# EasyEDA Pro project ProPrj_USB-DAC-PRO_2024-06-16.epro, board PCB3
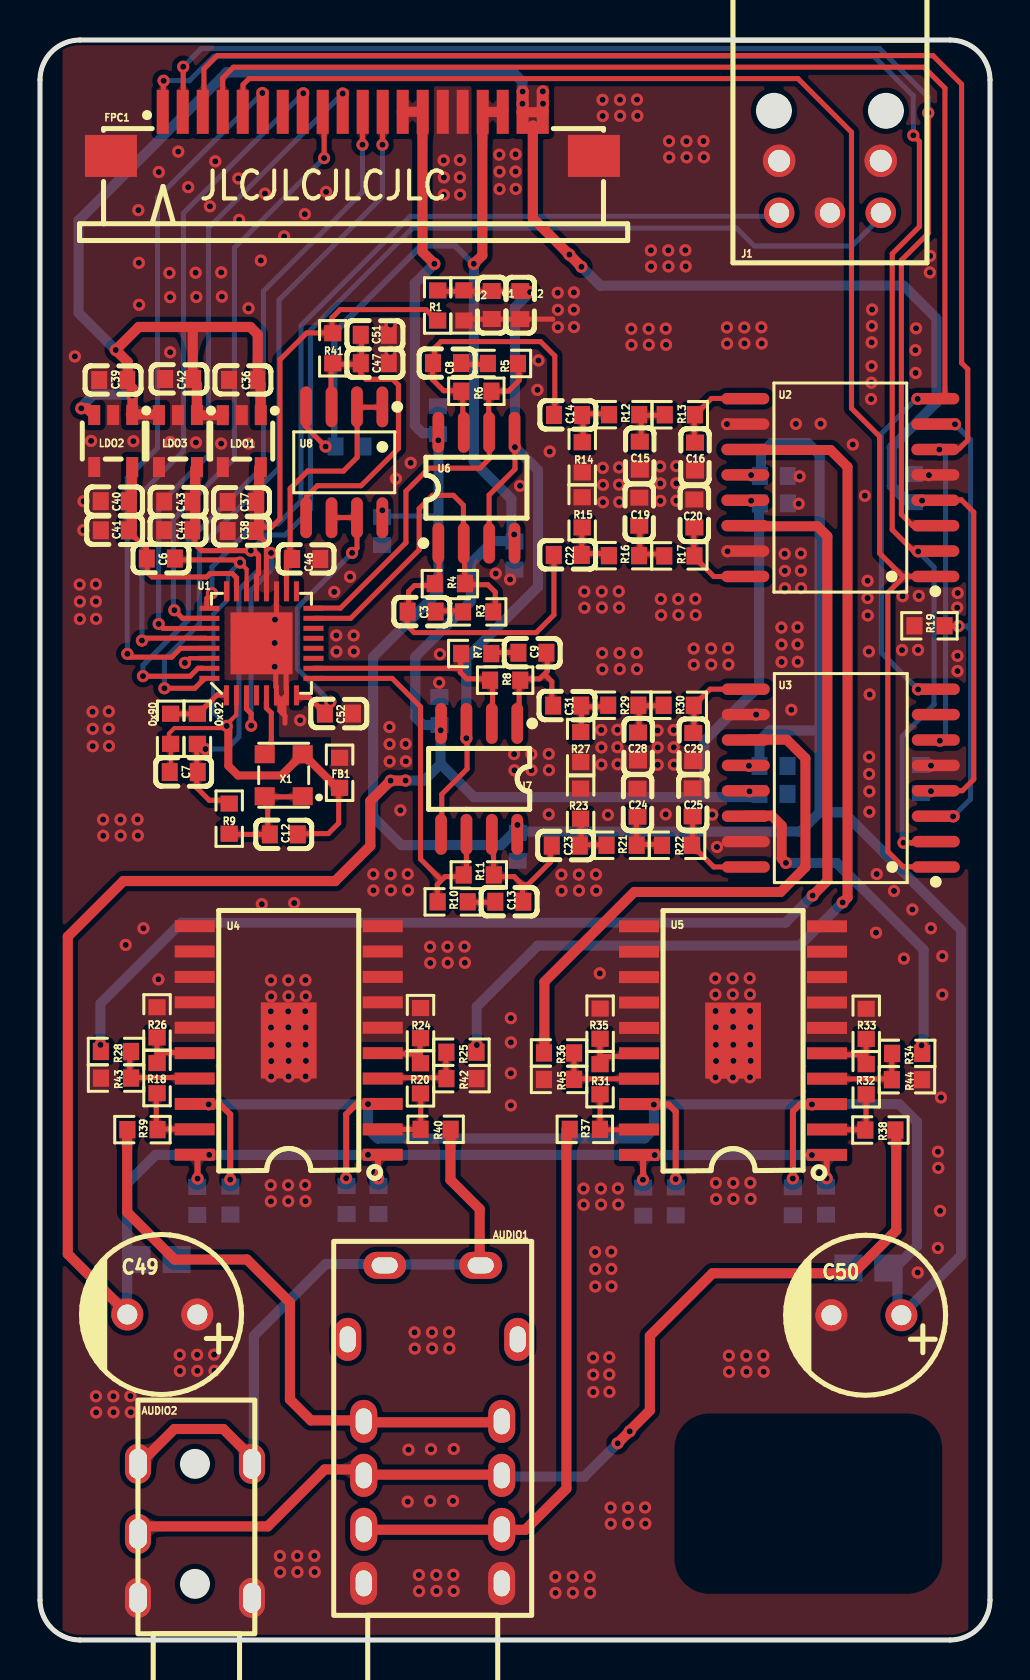
[diagram p10: board, top side]
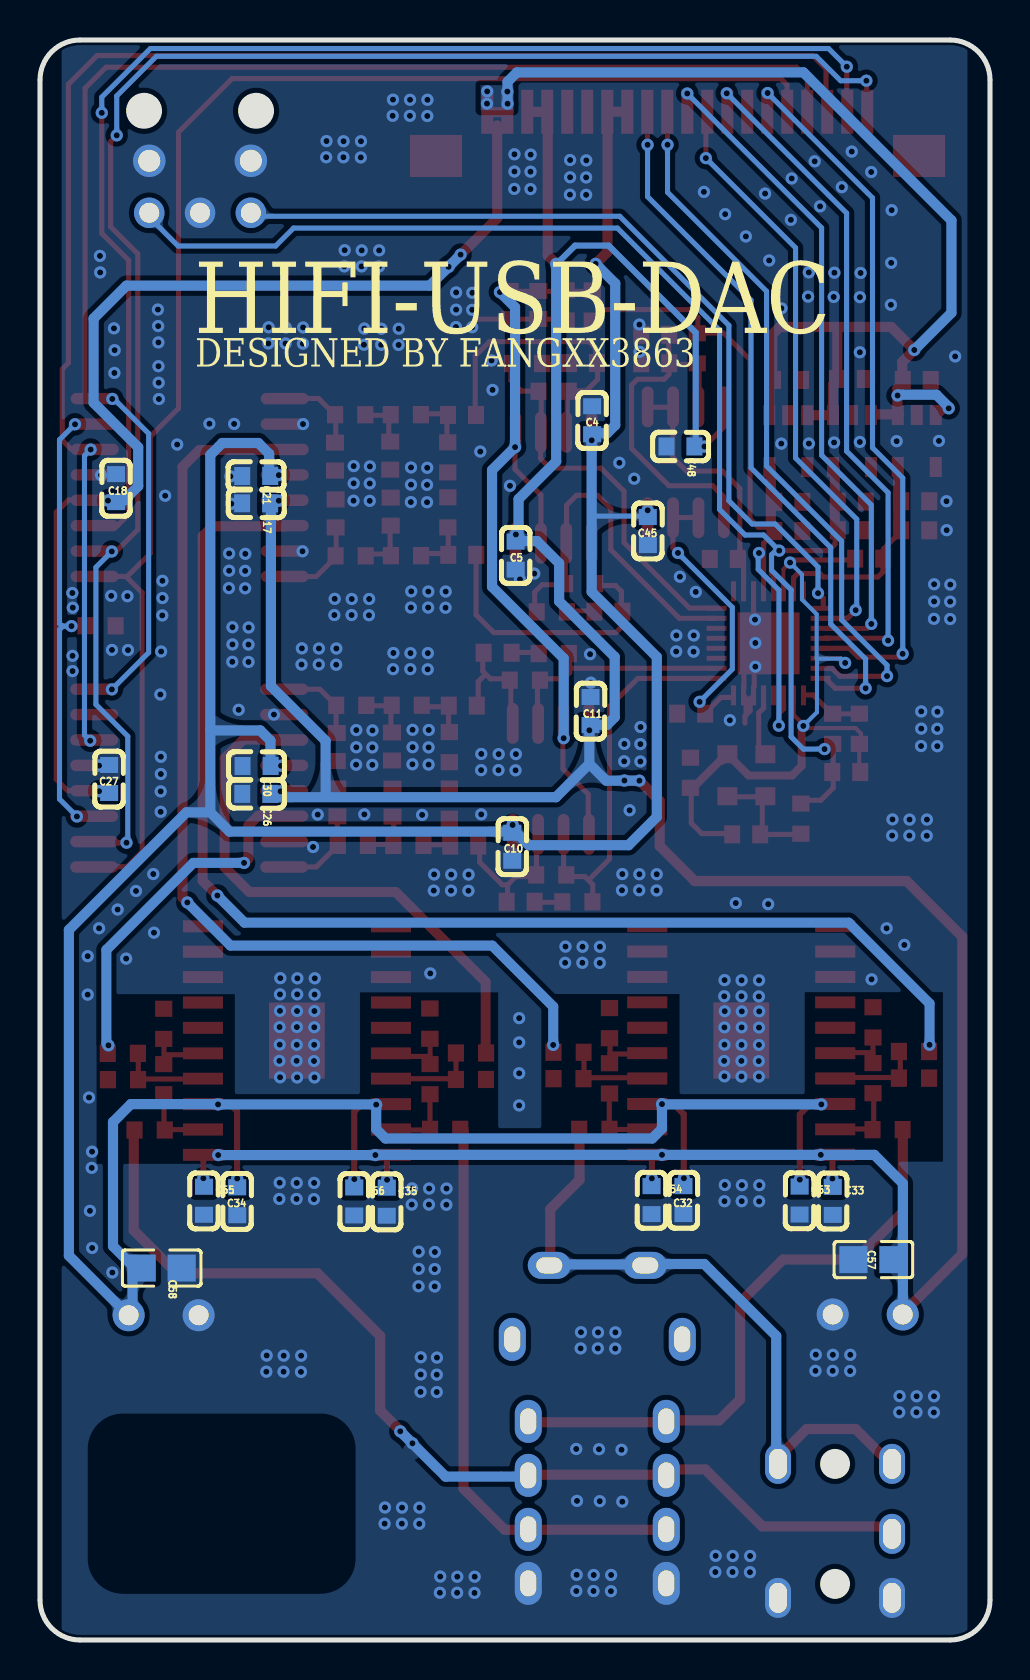
[diagram p11: board, bottom side, seen from below]

Outline 47.5 x 80 mm; copper layers: Top Layer, Bottom Layer. Coordinates in mm from the lower left corner of the outline.
Outline path: 0,78 0,2 arc(0.59,0.59) 2,0 45.5,0 arc(46.91,0.59) 47.5,2 47.5,78 arc(46.91,79.41) 45.5,80 2,80 arc(0.59,79.41) 0,78
Stack: Top Layer 0.035mm / Dielectric1 1.51mm FR4 er 4.5 / Bottom Layer 0.035mm

## Design rules (mm)
template: 自定义配置
spacing copperThickness1oz (default): track to track 0.102, other pairs 0.152 to 0.3
spacing copperThickness2oz: track to track 0.203, other pairs 0.152 to 0.3
track width copperThickness1oz (default): min 0.127, default 0.254, max 2.54
track width copperThickness2oz: min 0.203, default 0.254, max 2.54
differential pair differentialPair (default): width min 0.127, default 0.254, max 2.54; gap min 0.152, default 0.152
via viaSize (default): diameter min 0.5, default 0.61, max 10; hole min 0.3, default 0.305, max 6.3

## Placement (name value [footprint] x y rotation side)
0x90  0R  [R0603]  6.53 45.56 90 top
0x92  0R  [R0603]  7.87 45.56 90 top
AUDIO1  PJ-4.5/PJ-4005  [PJ-4005]  19.69 10.28 270 top
AUDIO2  PJ-3135-B  [AUDIO-TH_PJ-3135-B]  7.75 5.46 0 top
C1  100nF  [C0603]  22.59 66.75 90 top
C2  10uF  [C0603]  24.01 66.75 90 top
C3  100pF  [C0603]  19.08 51.42 180 top
C4  100nF  [C0603]  19.89 60.99 90 bottom
C5  100nF  [C0603]  23.72 54.22 270 bottom
C6  4.7uF  [C0603]  6.04 54.07 180 top
C7  100nF  [C0603]  7.19 43.4 0 top
C8  100pF  [C0603]  20.35 63.85 180 top
C9  100pF  [C0603]  24.62 49.36 0 top
C10  100nF  [C0603]  23.89 39.66 270 bottom
C11  100nF  [C0603]  19.97 46.45 90 bottom
C12  100nF  [C0603]  12.19 40.28 0 top
C13  100pF  [C0603]  23.47 36.91 0 top
C14  10uF  [C0603]  26.4 61.25 0 top
C15  1nF  [C0603]  29.99 59.22 90 top
C16  1nF  [C0603]  32.75 59.17 90 top
C17  100nF  [C0603]  36.69 56.83 0 bottom
C18  100nF  [C0603]  43.69 57.59 90 bottom
C19  1nF  [C0603]  29.96 56.42 90 top
C20  1nF  [C0603]  32.72 56.33 90 top
C21  100nF  [C0603]  36.69 58.2 180 bottom
C22  10uF  [C0603]  26.39 54.25 0 top
C23  10uF  [C0603]  26.29 39.72 0 top
C24  1nF  [C0603]  29.87 41.86 270 top
C25  1nF  [C0603]  32.63 41.88 270 top
C26  100nF  [C0603]  36.68 42.31 0 bottom
C27  100nF  [C0603]  44.04 43.05 90 bottom
C28  1nF  [C0603]  29.9 44.67 270 top
C29  1nF  [C0603]  32.66 44.65 270 top
C30  100nF  [C0603]  36.67 43.7 180 bottom
C31  10uF  [C0603]  26.36 46.72 0 top
C32  100nF  [C0603]  15.33 21.99 90 bottom
C33  100nF  [C0603]  7.86 21.96 90 bottom
C34  100nF  [C0603]  37.64 21.94 90 bottom
C35  100nF  [C0603]  30.16 21.92 90 bottom
C36  4.7uF  [C0603]  10.15 63 0 top
C37  4.7uF  [C0603]  10.08 56.9 0 top
C38  100nF  [C0603]  10.08 55.45 0 top
C39  4.7uF  [C0603]  3.66 63 0 top
C40  4.7uF  [C0603]  3.74 56.94 0 top
C41  100nF  [C0603]  3.74 55.48 0 top
C42  4.7uF  [C0603]  6.96 63.05 0 top
C43  4.7uF  [C0603]  6.91 56.92 0 top
C44  100nF  [C0603]  6.91 55.49 0 top
C45  100nF  [C0603]  17.11 55.45 270 bottom
C46  4.7uF  [C0603]  13.31 54.05 0 top
C47  100nF  [C0603]  16.74 63.84 180 top
C48  100nF  [C0603]  15.48 59.68 0 bottom
C49  470uF  [CAP-TH_BD8.0-P3.50-D0.6-FD]  6.11 16.28 180 top
C50  470uF  [CAP-TH_BD8.0-P3.50-D0.6-FD]  41.32 16.24 180 top
C51  10uF  [C0603]  16.74 65.26 180 top
C52  4.7uF  [C0603]  14.94 46.32 0 top
C53  100nF  [C0603]  9.52 21.97 90 bottom
C54  100nF  [C0603]  16.92 21.99 90 bottom
C55  100nF  [C0603]  39.3 21.96 90 bottom
C56  100nF  [C0603]  31.79 21.93 90 bottom
C57  10uF  [C0805]  5.83 19.02 180 bottom
C58  10uF  [C0805]  41.41 18.6 0 bottom
FB1  GZ1005E121CTF  [R0603]  14.98 43.36 90 top
FPC1  AFA07-S20FCC-00  [FPC-SMD_AFA07-S20FCC-00]  15.62 75.31 0 top
J1  -  [AUDIO-TH-SPDIF-DLT1160]  39.5 75.56 180 top
LDO1  LP5907MFX-3.3/NOPB  [SOT-23-5_L3.0-W1.7-P0.95-LS2.8-BR]  10.09 59.94 90 top
LDO2  LP5907MFX-1.5/NOPB  [SOT-23-5_L3.0-W1.7-P0.95-LS2.8-BR]  3.66 59.95 90 top
LDO3  LP5907MFX-3.3/NOPB  [SOT-23-5_L3.0-W1.7-P0.95-LS2.8-BR]  6.9 59.95 90 top
R1  10K  [R0603]  19.88 66.73 270 top
R2  8.2K  [R0603]  21.2 66.73 90 top
R3  100R  [R0603]  21.91 51.41 180 top
R4  1.2K  [R0603]  20.5 52.82 180 top
R5  100R  [R0603]  23.15 63.83 180 top
R6  1.2K  [R0603]  21.82 62.44 180 top
R7  100R  [R0603]  21.81 49.32 0 top
R8  1.2K  [R0603]  23.26 47.99 0 top
R9  10R  [R0603]  9.46 41.07 90 top
R10  100R  [R0603]  20.63 36.91 0 top
R11  1.2K  [R0603]  21.94 38.25 0 top
R12  300R  [R0603]  29.21 61.27 0 top
R13  300R  [R0603]  31.99 61.26 0 top
R14  47K  [R0603]  27.11 59.13 90 top
R15  47K  [R0603]  27.11 56.38 90 top
R16  300R  [R0603]  29.2 54.22 0 top
R17  300R  [R0603]  31.97 54.21 0 top
R18  1K  [R0603]  5.85 28.09 270 top
R19  100K  [R0603]  44.47 50.71 0 top
R20  1K  [R0603]  19.02 28.08 270 top
R21  300R  [R0603]  29.08 39.74 0 top
R22  300R  [R0603]  31.85 39.74 0 top
R23  47K  [R0603]  27.03 41.82 270 top
R24  1K  [R0603]  19.03 30.84 270 top
R25  47R  [R0603]  21.07 29.39 180 top
R26  1K  [R0603]  5.85 30.88 270 top
R27  47K  [R0603]  27.03 44.64 270 top
R28  47R  [R0603]  3.8 29.42 0 top
R29  300R  [R0603]  29.16 46.74 0 top
R30  300R  [R0603]  31.94 46.73 0 top
R31  1K  [R0603]  28 28.04 270 top
R32  1K  [R0603]  41.31 28.04 270 top
R33  1K  [R0603]  41.31 30.81 270 top
R34  47R  [R0603]  43.36 29.33 180 top
R35  1K  [R0603]  28 30.82 270 top
R36  47R  [R0603]  25.95 29.35 0 top
R37  27R  [R0603]  27.24 25.53 180 top
R38  27R  [R0603]  42.02 25.5 0 top
R39  27R  [R0603]  5.12 25.52 180 top
R40  27R  [R0603]  19.78 25.53 0 top
R41  47K  [R0603]  14.64 64.58 270 top
R42  4.7K  [R0603]  21.07 28.07 0 top
R43  4.7K  [R0603]  3.8 28.09 0 top
R44  4.7K  [R0603]  43.35 28.02 0 top
R45  4.7K  [R0603]  25.95 28.03 0 top
U1  -  [QFN32_9028Q2M]  11.07 49.83 90 top
U2  PGA2310UA/1KG4  [SOIC-16_L10.3-W7.5-P1.27-LS10.3-BL]  40.02 57.62 90 top
U3  PGA2310UA/1KG4  [SOIC-16_L10.3-W7.5-P1.27-LS10.3-BL]  40.04 43.1 90 top
U4  TPA6120A2DWPR  [HSOP-20_L12.9-W7.5-P1.27-BL-EP]  12.44 29.98 90 top
U5  TPA6120A2DWPR  [HSOP-20_L12.9-W7.5-P1.27-BL-EP]  34.65 29.97 90 top
U6  OPA1612AID  [SOIC-8_L4.9-W3.9-P1.27-LS6.2-BL]  21.82 57.61 0 top
U7  OPA1612AID  [SOIC-8_L4.9-W3.9-P1.27-LS6.2-BL]  21.96 43.06 180 top
U8  LM4562MA/NOPB  [SOIC-8_L4.9-W3.9-P1.27-LS6.0-BL]  15.21 58.89 180 top
X1  45.1584MHz  [OSC-SMD_4P-L3.2-W2.5-BL_ABRACON_AMPMEFX]  12.18 43.24 90 top

## Footprints (pads in the part's own frame, mm; a bottom-side part is the same pattern mirrored in y, then rotated)
AUDIO-TH-SPDIF-DLT1160
  round 1.524 hole 1: 1(2.54,4.2) 2(0,4.2) 3(-2.54,4.2)
  round 1.624 hole 1.1: 4(2.54,1.6) 5(-2.54,1.6)
AUDIO-TH_PJ-3135-B
  oval 1.3x2 hole 0.9x1.5: 1(-2.85,-3.35) 1(2.85,-3.35) 2(-2.85,-0.15) 3(-2.85,3.35) 3(2.85,3.35)
C0603
  rect 0.8x0.9 smd: 1(-0.7,0) 2(0.7,0)
C0805
  rect 1.41x1.35 smd: 1(-1,0) 2(1,0)
CAP-TH_BD8.0-P3.50-D0.6-FD
  round 1.6 hole 1: 1(-1.75,0) 2(1.75,0)
FPC-SMD_AFA07-S20FCC-00
  rect 0.6x2.2 smd: 1(-9.486,1.103) 2(-8.486,1.103) 3(-7.484,1.103) 4(-6.486,1.103) 5(-5.486,1.103) 6(-4.486,1.101) 7(-3.486,1.103) 8(-2.486,1.103) 9(-1.487,1.102) 10(-0.487,1.102) 11(0.513,1.102) 12(1.513,1.102) 13(2.513,1.102) 14(3.513,1.102) 15(4.515,1.101) 16(5.514,1.102) 17(6.514,1.102) 18(7.514,1.102) 19(8.514,1.102) 20(9.513,1.102)
  rect 2.6x2.1 smd: 21(-12.075,-1.103) 22(12.075,-1.103)
HSOP-20_L12.9-W7.5-P1.27-BL-EP
  rect 0.6x2 smd: 1(-5.715,-4.7) 2(-4.445,-4.7) 3(-3.175,-4.7) 4(-1.905,-4.7) 5(-0.635,-4.7) 6(0.635,-4.7) 7(1.905,-4.7) 8(3.175,-4.7) 9(4.444,-4.7) 10(5.715,-4.7) 11(5.715,4.7) 12(4.445,4.7) 13(3.175,4.7) 14(1.905,4.7) 15(0.635,4.7) 16(-0.635,4.7) 17(-1.905,4.7) 18(-3.175,4.7) 19(-4.445,4.7) 20(-5.715,4.7)
  rect 3.81x2.79 smd: 21(0,0)
OSC-SMD_4P-L3.2-W2.5-BL_ABRACON_AMPMEFX
  rect 0.9x1 smd: 1(-1.05,-0.95) 2(1.05,-0.95) 3(1.05,0.95) 4(-1.05,0.95)
PJ-4005
  oval 2.15x1.35 hole 1.3x0.8: 1(7.45,-3.5) 1(7.45,3.4) 2(4.75,-3.5) 2(4.75,3.4) 3(2.05,-3.5) 3(2.051,3.4) 4(-0.65,-3.5) 4(-0.649,3.4) 5(-4.75,4.199) 6(-4.75,-4.3)
  oval 1.35x2.15 hole 0.8x1.3: 7(-8.45,2.35) 7(-8.45,-2.45)
QFN32_9028Q2M
  rect 1.001x0.249 smd: 1(-2.601,1.75) 2(-2.601,1.25) 3(-2.601,0.75) 4(-2.601,0.249) 5(-2.601,-0.249) 6(-2.601,-0.75) 7(-2.601,-1.25) 8(-2.601,-1.75) 17(2.601,-1.75) 18(2.601,-1.25) 19(2.601,-0.75) 20(2.601,-0.249) 21(2.601,0.249) 22(2.601,0.75) 23(2.601,1.25) 24(2.601,1.75)
  rect 0.249x1.001 smd: 9(-1.75,-2.601) 10(-1.25,-2.601) 11(-0.75,-2.601) 12(-0.249,-2.601) 13(0.249,-2.601) 14(0.75,-2.601) 15(1.25,-2.601) 16(1.75,-2.601) 25(1.75,2.601) 26(1.25,2.601) 27(0.75,2.601) 28(0.249,2.601) 29(-0.249,2.601) 30(-0.75,2.601) 31(-1.25,2.601) 32(-1.75,2.601)
  rect 3.099x3.099 smd: 33(0,0)
R0603
  rect 0.806x0.864 smd: 1(-0.753,0) 2(0.753,0)
SOIC-8_L4.9-W3.9-P1.27-LS6.0-BL
  oval 0.588x2.045 smd: 1(-1.905,-2.772) 2(-0.635,-2.772) 3(0.635,-2.772) 4(1.905,-2.772) 5(1.905,2.772) 6(0.635,2.772) 7(-0.635,2.772) 8(-1.905,2.772)
SOIC-8_L4.9-W3.9-P1.27-LS6.2-BL
  oval 0.588x2.045 smd: 1(-1.905,-2.772) 2(-0.635,-2.772) 3(0.635,-2.772) 4(1.905,-2.772) 5(1.905,2.772) 6(0.635,2.772) 7(-0.635,2.772) 8(-1.905,2.772)
SOIC-16_L10.3-W7.5-P1.27-LS10.3-BL
  oval 0.574x2.401 smd: 1(-4.445,-4.75) 2(-3.175,-4.75) 3(-1.905,-4.75) 4(-0.635,-4.75) 5(0.635,-4.75) 6(1.905,-4.75) 7(3.175,-4.75) 8(4.445,-4.75) 9(4.445,4.75) 10(3.175,4.75) 11(1.905,4.75) 12(0.635,4.75) 13(-0.635,4.75) 14(-1.905,4.75) 15(-3.175,4.75) 16(-4.445,4.75)
SOT-23-5_L3.0-W1.7-P0.95-LS2.8-BR
  rect 1x0.6 smd: 1(1.3,-0.95) 2(1.3,0) 3(1.3,0.95) 4(-1.3,0.95) 5(-1.3,-0.95)

## Nets
As in the schematic.

Pads without a net: AUDIO1 5 6; U1 4 11 12 13 14 17 24; U3 7

## Via types
v1: diameter 0.61, hole 0.305, Top Layer to Bottom Layer, 492 vias

## Routing (per net, layer and track width the routed paths; a pad name or vN(x,y) marks a point on that pad's centre or on a via; arc(x,y) is an arc through that point)
5V: length 114.7
  Top Layer w0.254: 45.36,57 46.07,57 46.69,56.39 46.69,43.03 46.12,42.47 45.62,42.47 45.61,42.47
  Top Layer w0.508: v1(2.06,61.58) 2.36,61.58 2.69,61.25 ; 7.59,65.65 4.94,65.65 v1(3.79,64.5) 4.39,63.9 4.39,63.16 ; 7.59,65.65 10.52,65.65 10.89,65.28 10.89,63.11 ; 7.59,65.65 7.64,65.6 7.64,63.27 ; 7.8,61.24 9.18,61.24 9.19,61.23 ; 24.06,76.39 25.13,76.39 25.18,76.44 ; 7.65,62.96 7.85,62.76 7.85,61.48 ; 4.37,62.83 4.63,62.58 4.63,61.59 ; 5.89,61.3 5.87,61.28 4.54,61.28 ; 11.02,61.47 11.02,62.8 10.84,62.98 ; v1(27.07,68.66) 24.64,71.09 24.64,75.73
  Bottom Layer w0.508: v1(26.47,69.27) 26.47,69.26 v1(27.07,68.66) 28.01,67.72 43.18,67.72 44.82,66.08 44.82,61.86 42.59,59.64 42.59,57.69 43.31,56.97 43.93,56.97 ; v1(2.06,61.58) 2.06,61.65 2.68,62.27 4.58,62.27 v1(4.62,62.22) ; v1(3.79,64.5) 1.93,66.36 1.93,70.98 9.33,78.38 23.65,78.38 24.12,77.91 v1(24.12,76.81)
  vias: v1(24.13,77.42) v1(25.14,77.43) v1(25.15,76.82) v1(44.1,56.97) v1(44.55,42.44)
+12V: length 187.9
  Top Layer w0.305: v1(15.31,23.09) 15.31,23.09 15.31,26.29 15.82,26.8 v1(16.4,26.8) ; v1(8.43,26.78) 9.01,26.78 9.51,26.28 v1(9.51,23.02) ; v1(38.6,26.78) 37.99,26.78 37.65,26.44 37.65,23.08 v1(37.64,23.07) ; v1(30.69,26.77) 31.44,26.77 31.79,26.42 31.79,23.05
  Top Layer w0.508: 18.09,76.41 19.11,76.41 19.12,76.41 ; 19.12,75.88 19.12,69.4 v1(19.72,68.81)
  Bottom Layer w0.254: 19.85,56.28 19.76,56.19 17.23,56.19
  Bottom Layer w0.508: 23.93,40.42 38.02,40.42 38.98,41.39 ; v1(19.72,68.81) 18.74,67.83 18.74,60.74 19.14,60.34 19.87,60.34 ; 38.98,41.39 40.18,41.39 46.06,35.51 46.06,19.22 42.95,16.12 ; 38.98,41.39 38.98,45.48 ; v1(8.43,26.78) 16.39,26.78 v1(16.4,26.8) 16.4,25.57 16.89,25.08 30.22,25.08 30.69,25.54 v1(30.69,26.77) 30.7,26.78 v1(38.6,26.78) 38.61,26.79 42.95,26.79 43.85,25.9 43.85,19.69 42.87,18.72 42.87,16.26 ; 38.98,45.48 36.49,45.48 35.98,44.97 35.98,43.98 35.91,43.92 ; 38.98,45.48 38.98,59.25 38.38,59.85 36.58,59.85 36.04,59.31 36.04,58.28 36.03,58.26 ; 23.66,40.34 23.06,39.74 18.07,39.74 16.66,41.15 16.66,49.15 19.92,52.41 v1(19.92,59.98)
  vias: v1(17.12,56.48) v1(23.87,40.75) v1(31.78,23.05) v1(35.45,43.71) v1(35.56,58.24)
-12V: length 177.1
  Top Layer w0.254: 13.27,61.13 13.27,60.68 v1(14.28,59.67)
  Top Layer w0.305: 7.87,24.26 7.87,23.08 v1(7.88,23.07) ; 39.33,24.26 v1(39.33,23.09) ; 30.16,24.26 30.16,23.02 v1(30.15,23.01) ; v1(16.91,23.08) 16.9,23.09 16.9,24.26
  Top Layer w0.508: 22.18,76.41 23.13,76.41 23.16,76.44 ; 4.34,16.35 1.39,19.3 1.39,35.17 4.17,37.95 14.76,37.95 16.52,39.7 16.52,41.95 v1(17.53,42.97) 18.27,42.97 v1(18.28,42.97) ; v1(21.69,68.81) 22.12,69.23 22.12,75.89
  Bottom Layer w0.254: v1(14.28,59.67) 14.63,59.67 14.72,59.76
  Bottom Layer w0.305: v1(21.69,68.81) 21.66,68.81 20.75,69.72 19.07,69.72 14.72,65.37 14.72,59.76
  Bottom Layer w0.508: v1(20.03,45.49) 20.03,43.81 ; 20.03,43.81 19.19,42.97 v1(17.53,42.97) ; 20.03,43.81 21.7,42.14 35.78,42.14 35.96,42.32 ; 23.57,55.12 23.57,57.05 21.69,58.93 v1(21.69,68.81) ; 4.36,16.46 4.36,22.83 5.78,24.25 8.46,24.25 v1(8.46,24.26) 16.4,24.26 ; v1(16.4,24.26) 30.72,24.26 v1(30.73,24.25) v1(38.59,24.25) ; 35.95,56.82 35.95,47.69 33.22,44.96 33.22,42.22 33.17,42.17 ; 23.59,54.95 22.66,54.95 21.54,53.84 21.54,51.93 18.76,49.15 18.76,46.14 19.15,45.76 19.92,45.76 19.95,45.79
  vias: v1(23.71,55.28) v1(35.47,42.43) v1(35.56,56.97)
AGND: length 9.9
  Top Layer w0.254: 12.34,48.52 12.31,48.49 12.31,47.54 ; 12.32,47.22 12.19,47.1 12.19,46.28 ; 11.84,47.2 12,47.04 12,46.46 12.25,46.2 12.25,45.84 ; 21.24,66.04 25.62,66.04 25.64,66.03 ; 11.79,47.64 11.79,48.48 11.82,48.51 ; 11.82,52.19 11.82,51.07
  vias: v1(1.74,64.18) v1(1.98,52.77) v1(1.99,51.92) v1(1.99,51.05) v1(2.18,56.94) v1(2.17,55.49) v1(2.55,59.95) v1(2.63,46.41) v1(2.64,45.56) v1(2.64,44.69) v1(2.79,52.79) v1(2.79,51.93) v1(2.8,12.19) v1(2.8,51.06) v1(2.81,11.38) v1(3.15,41.02) v1(3.16,40.21) v1(3.44,46.43) v1(3.44,45.57) v1(3.45,44.7) v1(3.67,12.19) v1(3.68,11.39) v1(4.02,41.02) v1(4.03,40.22) v1(4.28,34.75) v1(4.52,12.2) v1(4.54,11.39) v1(4.67,59.94) v1(4.88,41.03) v1(4.89,40.22) v1(4.92,71.49) v1(4.94,68.86) v1(4.96,66.76) v1(5.17,35.59) v1(5.94,73.4) v1(5.92,33.03) v1(6.47,68.35) v1(6.51,67.14) v1(6.51,64.39) v1(6.51,59.9) v1(6.91,74.42) v1(6.99,14.26) v1(7,13.45) v1(7.41,72.64) v1(7.78,68.36) v1(7.8,59.88) v1(7.82,67.15) v1(7.86,14.26) v1(7.87,13.46) v1(8.5,71.68) v1(8.77,73.93) v1(8.71,14.27) v1(8.73,13.46) v1(9.06,68.38) v1(9.09,67.17) v1(9.06,59.82) v1(9.92,73.08) v1(9.96,71.01) v1(10.43,66.58) v1(10.44,59.82) v1(11.04,68.98) v1(11.09,36.79) v1(11.25,72.32) v1(11.55,32.99) v1(11.56,32.18) v1(11.54,31.43) v1(11.55,30.62) v1(11.55,29.76) v1(11.56,28.95) v1(11.56,28.17) v1(11.54,22.74) v1(11.54,21.93) v1(11.75,51.02) v1(11.73,49.85) v1(11.73,48.67) v1(11.99,4.2) v1(12,3.39) v1(12.21,70.18) v1(12.42,32.99) v1(12.43,32.19) v1(12.41,31.43) v1(12.42,30.63) v1(12.42,29.76) v1(12.43,28.95) v1(12.43,28.17) v1(12.41,22.74) v1(12.41,21.94) v1(12.71,36.85) v1(12.86,4.2) v1(12.87,3.4) v1(13.01,45.99) v1(13.24,71.29) v1(13.27,33) v1(13.29,32.19) v1(13.26,31.44) v1(13.28,30.63) v1(13.28,29.77) v1(13.29,28.95) v1(13.28,28.18) v1(13.26,22.75) v1(13.28,21.94) v1(13.72,4.21) v1(13.73,3.4) v1(14.3,72.41) v1(14.71,52.4) v1(14.81,50.23) v1(14.82,49.42) v1(15.5,53.16) v1(15.68,50.23) v1(15.69,49.43) v1(16.66,38.29) v1(16.67,37.48) v1(17.47,45.65) v1(17.48,44.8) v1(17.48,43.93) v1(17.53,65.77) v1(17.52,64.41) v1(17.53,38.29) v1(17.54,37.49) v1(17.79,58.06) v1(18.02,41.49) v1(18.28,44.8) v1(18.29,43.93) v1(18.39,38.3) v1(18.39,6.92) v1(18.4,37.49) v1(18.42,9.51) v1(18.53,58.86) v1(18.73,15.38) v1(18.74,14.57) v1(18.94,3.25) v1(18.95,2.44) v1(19.5,34.66) v1(19.51,33.85) v1(19.6,15.38) v1(19.55,9.54) v1(19.51,6.94) v1(19.61,14.58) v1(19.81,3.25) v1(19.82,2.45) v1(20,49.29) v1(19.96,47.87) v1(20.19,73.98) v1(20.19,73.13) v1(20.19,72.26) v1(20.37,34.66) v1(20.38,33.86) v1(20.45,15.39) v1(20.47,14.58) v1(20.69,9.55) v1(20.65,6.96) v1(20.67,3.26) v1(20.69,2.45) v1(21,74) v1(21,73.14) v1(21,72.27) v1(21.23,34.67) v1(21.24,33.86) v1(22.79,53.32) v1(22.97,74.27) v1(22.98,73.42) v1(22.98,72.55) v1(23.5,53.03) v1(23.54,31.09) v1(23.54,29.88) v1(23.54,28.34) v1(23.54,26.73) v1(23.78,74.29) v1(23.78,73.42) v1(23.79,72.55) v1(23.71,44.29) v1(23.72,43.48) v1(24,57.71) v1(24.57,44.29) v1(24.58,43.49) v1(24.87,62.51) v1(24.92,63.98) v1(25.49,59.42) v1(25.44,44.3) v1(25.45,43.49) v1(25.44,41.28) v1(25.77,3.16) v1(25.78,2.35) v1(25.88,67.36) v1(25.89,66.51) v1(25.89,65.64) v1(26.07,38.27) v1(26.08,37.46) v1(26.69,67.38) v1(26.69,66.52) v1(26.64,3.16) v1(26.65,2.36) v1(26.7,65.65) v1(26.94,38.27) v1(26.95,37.47) v1(27.17,22.57) v1(27.18,21.76) v1(27.22,52.42) v1(27.22,51.61) v1(27.49,3.17) v1(27.51,2.36) v1(27.65,14.12) v1(27.66,13.27) v1(27.66,12.4) v1(27.79,38.28) v1(27.76,19.4) v1(27.76,18.55) v1(27.76,17.68) v1(27.81,37.47) v1(27.99,33.33) v1(28.09,52.42) v1(28.09,51.62) v1(28.06,45.5) v1(28.07,44.63) v1(28.07,43.77) v1(28.04,22.57) v1(28.05,21.77) v1(28.13,77.01) v1(28.14,76.2) v1(28.14,58.61) v1(28.15,57.76) v1(28.15,56.89) v1(28.11,49.34) v1(28.12,48.53) v1(28.39,41.26) v1(28.46,14.14) v1(28.46,13.28) v1(28.47,12.41) v1(28.57,19.42) v1(28.57,18.56) v1(28.57,17.69) v1(28.53,6.62) v1(28.54,5.81) v1(28.87,45.51) v1(28.87,44.64) v1(28.88,43.79) v1(28.9,22.58) v1(29,77.01) v1(28.95,58.63) v1(28.95,57.77) v1(28.96,56.9) v1(28.94,52.43) v1(28.96,51.62) v1(28.98,49.34) v1(28.99,48.54) v1(28.91,21.77) v1(29.01,76.21) v1(29.4,6.62) v1(29.41,5.82) v1(29.56,65.56) v1(29.57,64.75) v1(29.85,77.02) v1(29.87,76.21) v1(29.83,49.35) v1(29.85,48.54) v1(30.25,6.63) v1(30.27,5.82) v1(30.43,65.56) v1(30.44,64.76) v1(30.54,69.48) v1(30.55,68.67) v1(30.88,45.48) v1(30.88,44.63) v1(30.88,43.76) v1(31,58.68) v1(31.01,57.83) v1(31.01,56.96) v1(31.04,52.05) v1(31.05,51.24) v1(31.29,65.57) v1(31.28,41.28) v1(31.3,64.76) v1(31.45,74.94) v1(31.46,74.13) v1(31.41,69.48) v1(31.42,68.68) v1(31.69,45.5) v1(31.69,44.64) v1(31.69,43.77) v1(31.82,58.7) v1(31.82,57.83) v1(31.82,56.96) v1(31.91,52.05) v1(31.92,51.25) v1(32.27,69.49) v1(32.28,68.68) v1(32.32,74.94) v1(32.33,74.14) v1(32.68,49.57) v1(32.69,48.76) v1(32.77,52.06) v1(32.78,51.25) v1(33.18,74.95) v1(33.19,74.14) v1(33.55,49.57) v1(33.56,48.77) v1(33.61,41.27) v1(33.76,33.08) v1(33.77,32.27) v1(33.78,31.45) v1(33.79,30.64) v1(33.79,29.76) v1(33.78,28.13) v1(33.79,22.85) v1(33.85,39.65) v1(33.8,28.95) v1(33.8,22.04) v1(34.34,65.63) v1(34.35,64.82) v1(34.35,60.8) v1(34.38,54.44) v1(34.41,49.58) v1(34.42,48.77) v1(34.44,14.22) v1(34.45,13.41) v1(34.63,33.08) v1(34.64,32.28) v1(34.65,31.45) v1(34.66,30.65) v1(34.66,29.76) v1(34.67,28.96) v1(34.65,28.13) v1(34.66,22.85) v1(34.67,22.05) v1(35.22,65.63) v1(35.22,64.83) v1(35.31,14.22) v1(35.32,13.41) v1(35.48,33.09) v1(35.5,28.14) v1(35.5,32.28) v1(35.5,31.46) v1(35.52,30.65) v1(35.51,29.77) v1(35.53,28.96) v1(35.52,22.86) v1(35.53,22.05) v1(35.8,46.27) v1(36.07,65.64) v1(36.08,64.83) v1(36.17,14.22) v1(36.18,13.41) v1(37.07,50.62) v1(37.08,49.77) v1(37.08,48.9) v1(37.24,54.31) v1(37.24,53.46) v1(37.24,52.59) v1(37.57,46.51) v1(37.79,60.8) v1(37.88,50.64) v1(37.88,49.78) v1(37.89,48.91) v1(37.98,58.18) v1(37.93,56.81) v1(38.05,54.33) v1(38.05,53.46) v1(38.05,52.59) v1(39.03,60.81) v1(40.64,59.77) v1(41.24,57.21) v1(41.38,52.96) v1(41.38,52.1) v1(41.39,51.23) v1(41.44,49.42) v1(41.48,47.28) v1(41.46,44.16) v1(41.46,43.3) v1(41.47,42.43) v1(41.47,41.41) v1(41.59,65.7) v1(41.58,64.88) v1(41.58,63.69) v1(41.57,62.86) v1(41.56,62.05) v1(41.6,66.52) v1(41.84,38.3) v1(41.8,35.37) v1(42.7,37.45) v1(43.13,52.19) v1(43.1,49.5) v1(43.19,34.07) v1(43.62,36.52) v1(43.77,64.49) v1(43.78,63.35) v1(43.8,65.58) v1(43.88,18.37) v1(43.94,52.21) v1(43.9,49.5) v1(44.49,68.38) v1(44.45,58.24) v1(44.5,69.2) v1(44.55,43.72) v1(44.55,35.59) v1(44.9,24.42) v1(44.89,19.6) v1(44.91,23.61) v1(45.05,27.12) v1(45,21.46) v1(45.12,34.19) v1(45.12,32.27) v1(45.88,52.35) v1(45.86,51.62) v1(45.87,49.21) v1(45.87,48.45)
AVCCL: length 12.3
  Top Layer w0.254: 15.86,61.35 15.86,59.13 15.18,58.45 13.38,58.45 12.51,57.57 12.51,54.5 12.32,54.31 12.32,52.77 ; 17.07,61.62 17.05,61.64 15.83,61.64
AVCCR: length 14.2
  Top Layer w0.254: 15.85,55.67 15.85,54.6 v1(15.6,54.35) ; 12.85,47.13 13.45,47.13 14.09,46.49 ; v1(14.52,46.91) 14.52,46.58 14.22,46.28 ; 15.91,56.16 15.86,56.12 14.64,56.12
  Bottom Layer w0.254: v1(14.52,46.91) 12.88,48.55 12.88,51.63 v1(15.6,54.35)
DVDD: length 10.2
  Top Layer w0.254: 5.36,53.78 5.36,53.4 5.61,53.15 8.34,53.15 8.51,53.32 9.61,53.32 9.82,53.12 9.82,52.73 9.83,52.73 ; 5.32,54.01 5.32,54.55 4.65,55.22
  Top Layer w0.508: 4.59,58.52 4.59,55.52 4.48,55.4
GND: length 34.3
  Top Layer w0.203: 6.5,43.34 6.54,43.39 6.54,44.6 ; v1(7.24,48.86) 7.48,49.09 8.17,49.09 ; 9.81,46.84 9.81,46.26 9.34,45.78 v1(9.34,45.7) 9.42,45.62 9.42,45.6 6.72,45.6 6.45,45.32 6.45,44.85 ; 10,53.87 10.33,53.54 10.33,52.91
  Top Layer w0.254: 12.91,40.32 14.41,40.32 14.93,40.84 14.93,42.5 15.05,42.61 ; 6.9,54 9.87,54 v1(10,53.87)
  Top Layer w0.4: 14.95,42.59 14.92,42.56 14.9,42.56 13.5,43.96 13.43,43.96 13.34,44.05 ; 12.87,44.03 12.07,43.23 9.9,43.23 9.42,43.71 9.42,45.6
  Bottom Layer w0.203: v1(7.24,48.86) 7.45,49.07 8.67,49.07 ; v1(9.34,45.7) 8.65,46.39 8.65,49.05 8.67,49.07 ; 8.67,49.07 8.67,51.29 9.4,52.03 9.4,53.28 v1(10,53.87)
VCCA: length 34.3
  Top Layer w0.254: 10.94,55.63 10.95,55.64 11.58,55.64 12,56.06 12,64.01 ; 19.66,66.16 19.3,66.52 15.01,66.52 14.6,66.12 14.6,65.55 ; 10.32,46.89 10.32,46.55 10.56,46.32 v1(10.56,45.72) ; 12,64.02 13.34,65.35 14.69,65.35 ; 11.32,52.95 11.32,54.84 10.88,55.28
  Top Layer w0.508: 10.96,58.61 10.96,55.64
  Bottom Layer w0.254: 11.59,54.41 11.59,54.4 11.59,53.53 10.55,52.5 10.55,45.72 v1(10.56,45.72)
  vias: v1(11.55,54.35)
VDD33: length 68.8
  Top Layer w0.254: 7.93,44.75 8.13,44.55 v1(8.27,44.55) ; 10.82,52.85 10.82,53.21 10.93,53.32 10.93,54.21 10.68,54.47 8.07,54.47 7.75,54.8 7.75,55.25 7.8,55.3 ; 9.37,41.95 9.33,41.99 8.46,41.99 7.84,42.61 7.84,44.71
  Top Layer w0.508: 7.76,58.57 7.76,55.48 7.67,55.4
  Bottom Layer w0.254: 10.79,54.39 10.92,54.27 10.92,53.49 9.94,52.51 9.94,45.16 9.33,44.55 v1(8.27,44.55) ; 41.97,71.07 40.6,69.7 35.72,69.7 34.82,70.6 18.63,70.6 13.52,65.49 13.52,56.53 12.24,55.25 11.32,55.25 v1(10.54,54.47)
BAL-L-COLD: length 3.3
  Top Layer w0.254: 5.81,25.55 5.89,25.46 ; 5.81,25.55 5.81,27.29 ; 5.81,25.55 7.26,25.55
BAL-L-HOT: length 3.4
  Top Layer w0.254: 19.03,25.57 18.99,25.53 17.41,25.53 ; 19.04,27.32 19.04,25.62 19.01,25.59
BAL-R-COLD: length 3.8
  Top Layer w0.254: 28,27.26 28,25.54 27.97,25.5 29.9,25.5 29.95,25.56
BAL-R-HOT: length 3.6
  Top Layer w0.254: 41.3,27.28 41.3,25.59 41.29,25.57 ; 41.2,25.57 41.15,25.52 39.35,25.52
DAC_DATA/DSD_DATA_R: length 29.5
  Top Layer w0.254: 8.47,51.09 7.12,51.09 v1(6.72,51.49) ; v1(14.21,74.09) 14.21,75.96
  Bottom Layer w0.254: v1(6.72,51.49) 6.66,51.54 6.66,56.04 9.72,59.1 9.72,69.61 v1(14.21,74.09)
DAC_LRCK/DSD_DATA_L: length 33.1
  Top Layer w0.254: v1(5.93,50.8) 6.16,50.58 8.17,50.58 ; 15.09,76.9 15.14,76.95 v1(15.14,77.32)
  Bottom Layer w0.254: 5.93,50.8 5.93,56.75 8.42,59.24 8.42,70.61 v1(15.14,77.32)
DAC_RST: length 35.6
  Top Layer w0.254: v1(11.12,77.35) 11.12,77.01 11.11,77 ; 8.48,49.59 7.03,49.59 6.59,49.14 4.53,49.14 v1(4.37,49.31)
  Bottom Layer w0.254: v1(11.12,77.35) 5.88,72.11 5.88,59.61 4.36,58.1 4.36,49.31 v1(4.37,49.31)
DAC_SCLK/DSD_SCLK: length 34.1
  Top Layer w0.254: v1(13.16,77.34) 13.16,77.27 13.14,77.24 ; 8.29,50.09 5.22,50.09 v1(5.1,49.97)
  Bottom Layer w0.254: v1(13.16,77.34) 7.17,71.34 7.17,59.44 5.1,57.37 v1(5.1,49.97)
DACL: length 16.9
  Top Layer w0.254: 22.75,51.61 22.77,51.62 22.77,52.39 22.4,52.76 21.18,52.76 21.23,52.81 21.23,54.43 ; 13.68,51.08 15.53,51.08 18.96,54.51 18.96,56.57 19.62,57.23 20.67,57.23 21.17,56.73 21.17,55.48
DACLB: length 18.3
  Top Layer w0.254: 23.96,63.72 23.95,63.71 23.95,62.97 23.43,62.45 22.44,62.45 22.44,60.97 22.38,60.92 ; 22.48,59.91 22.47,59.9 22.47,59.06 22,58.59 19.45,58.59 18.3,57.44 18.3,54.87 15.02,51.6 13.62,51.6
DACO-LN: length 15.6
  Top Layer w0.254: 19.62,52.72 18.72,52.72 18.43,52.43 18.43,51.64 18.38,51.59 ; 19.95,54.69 19.95,53.08 19.76,52.89 ; 25.77,54.22 25.7,54.14 25.7,51.26 24.81,50.37 18.71,50.37 18.35,50.73 18.35,51.43
DACO-LP: length 14.1
  Top Layer w0.254: 21.14,60.7 21.14,62.39 21.07,62.46 20.19,62.46 19.62,63.03 19.62,63.72 ; 25.79,61.39 25.74,61.44 25.74,64.2 25.02,64.92 20.05,64.92 19.73,64.6 19.73,63.95
DACO-RN: length 5.4
  Top Layer w0.254: 25.59,46.69 25.59,47.92 25.28,48.23 ; 23.89,46.45 23.96,46.51 23.96,47.89 ; 25.36,49.36 25.36,48.44 24.98,48.06 24.21,48.06
DACO-RP: length 7
  Top Layer w0.254: 24.12,37.76 24.12,37.76 24.12,36.99 ; 24.12,37.76 23.71,38.17 22.68,38.17 ; 24.12,37.76 24.38,37.76 25.52,38.89 25.52,39.73 ; 22.66,38.31 22.68,38.32 22.68,40.19
DACR: length 11.6
  Top Layer w0.254: 22.63,46.17 22.63,47.87 22.57,47.92 ; 13.68,48.59 21,48.59 21,48.58 ; 22.56,48.06 21.33,48.06 21.01,48.38 21.01,49.18 21.04,49.21
DACRB: length 19.1
  Top Layer w0.254: 13.68,48.08 17.61,48.08 19.03,46.66 19.03,39.05 20.02,38.05 ; 21.19,38.32 21.32,38.45 21.32,40.17 ; 21.1,38.17 20.26,38.17 19.86,37.77 19.86,37.06 19.94,36.98
MCLK: length 2.5
  Top Layer w0.254: 11.5,44.56 11.57,44.62 11.57,46.35 11.32,46.6 11.32,46.88
OFFSET: length 39.7
  Top Layer w0.254: 21.39,45.53 21.35,45.49 21.35,43.55 20.09,42.29 20.09,40.66 ; 23.75,59.9 23.75,58.54 22.46,57.25 22.46,55.5 ; 24.2,67.41 24.18,67.43 19.76,67.43
  Top Layer w0.508: v1(24.5,67.39) 24.49,67.41 24.15,67.41
  Bottom Layer w0.508: v1(24.5,67.39) 23.75,66.64 v1(23.75,59.64) 24.9,58.49 24.9,52.67 21.32,49.08 v1(21.32,45.09)
PGA_SDO: length 21.3
  Top Layer w0.254: v1(45.93,50.7) 45.48,50.7 45.46,50.71
  Bottom Layer w0.254: v1(45.75,60.79) 46.53,60.01 46.53,50.82 46.37,50.67 ; 46.37,50.67 46.35,50.7 v1(45.93,50.7) ; 46.37,50.67 46.53,50.52 46.53,42.05 v1(45.66,41.18)
SCL: length 35.7
  Top Layer w0.254: 16.13,76.22 16.13,74.76 ; v1(5.15,48.19) 5.16,48.19 7.5,48.19 7.9,48.59 8.14,48.59
  Bottom Layer w0.254: v1(5.15,48.19) 5.15,48.74 7.42,51.01 7.42,54.95 11.17,58.7 11.17,67.44 16.12,72.39 v1(16.12,74.76)
SDA: length 34.8
  Top Layer w0.254: 8.19,48.03 7.74,47.59 v1(6.22,47.59) ; v1(17.12,74.76) 17.13,74.77 17.13,75.74
  Bottom Layer w0.254: v1(17.12,74.76) 17.12,72.17 11.95,67 11.95,58.61 7.97,54.62 7.97,50.8 6.22,49.05 v1(6.22,47.59)
SIGN-L: length 33.7
  Top Layer w0.508: 22.04,18.61 21.98,18.67 21.98,21.54 20.52,23 20.52,25.54 ; 10.75,8.97 9.17,10.55 6.72,10.55 4.91,8.74
  Bottom Layer w0.508: 10.63,9.07 10.69,9.13 10.69,15.2 14.29,18.8 17.08,18.8 ; 17.09,18.78 21.84,18.78 21.94,18.68
SIGN-R: length 52.1
  Top Layer w0.508: 22.98,8.27 16.19,8.27 ; 5.17,5.62 5.23,5.68 11.39,5.68 14.24,8.53 16.28,8.53 ; v1(28.88,9.84) 29.48,10.44 v1(29.49,10.44) 29.49,10.47 30.49,11.48 30.49,15.21 33.62,18.34 40.66,18.34 42.81,20.49 42.81,25.49
  Bottom Layer w0.508: v1(29.49,10.44) 27.22,8.17 22.95,8.17
SPDIF_IN: length 43.1
  Top Layer w0.254: 8.34,51.63 8.34,52.08 v1(8.6,52.34)
  Bottom Layer w0.254: v1(8.6,52.34) 8.6,53.65 10.74,55.8 11.89,55.8 13.06,56.96 13.06,65.73 18.51,71.19 36.86,71.19 37.11,71.44
VOL-CS: length 81
  Top Layer w0.254: 44.72,54.47 43.66,54.47 42.61,55.51 42.61,69.31 43.97,70.67 43.97,74.93 v1(43.66,75.23) ; 6.16,77.17 6.16,77.95 v1(6.18,77.96) ; v1(43.18,39.86) 43.57,39.86 43.58,39.85 44.03,39.85
  Bottom Layer w0.254: v1(43.91,54.43) 44.7,53.63 44.7,46.78 43.11,45.19 43.11,39.93 v1(43.18,39.86) ; v1(43.66,75.23) 43.66,77.2 41.68,79.18 8.69,79.18 7.47,77.96 v1(6.18,77.96)
VOL-LN: length 3.3
  Top Layer w0.254: 34.34,53.17 33.69,53.17 32.81,54.05 ; 32.69,54.15 32.69,55.54 32.66,55.58
VOL-LP: length 3.3
  Top Layer w0.254: 33.02,61.52 33.57,62.08 34.62,62.08 34.63,62.06 ; 32.76,61.31 32.71,61.26 32.71,59.88
VOL-MUTE: length 70.3
  Top Layer w0.254: 45.25,62.08 45.25,77.59 44.2,78.64 9.67,78.64 9.13,78.1 9.13,77.13 ; v1(43.91,47.53) 44.81,47.53 44.82,47.52
  Bottom Layer w0.254: v1(43.89,62.05) 43.8,62.05 42.07,60.32 42.07,49.37 v1(43.91,47.53)
VOL-RN: length 3.5
  Top Layer w0.254: 34.69,47.54 33.51,47.54 32.84,46.88 ; 32.7,46.74 32.7,45.4 32.69,45.39
VOL-RP: length 3.6
  Top Layer w0.254: 32.89,39.45 33.69,38.65 34.73,38.65 ; 32.6,39.69 32.64,39.73 32.64,41.11
VOL-SCLK: length 74.8
  Top Layer w0.254: 44.82,59.56 45.96,59.56 46.39,59.99 46.39,63.54 46.08,63.85 46.08,77.79 44.65,79.22 8.86,79.22 8.2,78.56 8.2,77.29 8.19,77.29 ; 45.02,44.98 45,44.96 v1(44.99,44.96) ; 44.75,59.41 44.86,59.41 v1(44.97,59.52)
  Bottom Layer w0.254: v1(44.97,59.52) 45.28,59.21 45.28,45.25 v1(44.99,44.96)
VOL-SDI: length 62.9
  Top Layer w0.254: v1(7.16,78.66) 7.16,77.35 7.21,77.3 ; v1(44.41,76.36) 44.41,70.33 43.07,68.99 43.07,56.28 43.62,55.72 44.26,55.72
  Bottom Layer w0.254: v1(7.16,78.66) 8.07,79.57 41.98,79.57 44.41,77.14 v1(44.41,76.36)
VOL-ZCEN: length 72.9
  Top Layer w0.254: 10.15,77.11 10.15,77.76 10.46,78.07 37.9,78.07 40.57,75.39 40.57,61.58 41.98,60.18 41.98,54.33 43.14,53.18 44.37,53.18 ; 43.2,53.17 42.39,52.37 42.39,39.42 43.16,38.66 44.11,38.66
VOLADJ-LN: length 62.5
  Top Layer w0.5: v1(38.63,37.22) 39.37,37.96 39.37,55.19 38.87,55.69 35.22,55.69
  Bottom Layer w0.5: v1(38.63,37.22) 37.27,35.87 7.07,35.87 3.02,31.82 v1(3.02,29.76)
VOLADJ-LP: length 49.7
  Top Layer w0.5: v1(40.13,36.88) 40.38,37.12 40.38,58.65 39.53,59.5 35.23,59.5
  Bottom Layer w0.5: v1(21.84,29.75) 21.84,29.76 21.84,31.67 24.89,34.72 37.97,34.72 v1(40.13,36.88)
VOLADJ-RN: length 27.5
  Top Layer w0.5: 29.72,37.4 37.03,37.4 38.27,38.64 38.27,44.08 37.34,45.02 35.49,45.02 35.47,45.03 ; 25.16,29.49 25.22,29.55 25.22,32.91 29.72,37.41
VOLADJ-RP: length 17.4
  Top Layer w0.5: 35.3,41.22 36.58,41.22 37.08,40.72 37.08,39.07 v1(37.3,38.86)
  Bottom Layer w0.5: v1(44.08,29.73) 44.18,29.84 44.18,34.51 39.83,38.86 v1(37.3,38.86)
$2N47874: length 5.5
  Top Layer w0.254: 11.23,42.16 11.38,42 11.38,40.45 ; 11.23,42.16 11.21,42.14 ; 11.23,42.16 13.08,42.16 ; 11.3,40.25 11.28,40.28 9.48,40.28
$2N100163: length 1.3
  Top Layer w0.254: 20.98,63.78 22.31,63.78 22.32,63.78
$2N100240: length 1.3
  Top Layer w0.254: 22.6,49.38 23.9,49.38
$2N100269: length 1.4
  Top Layer w0.254: 22.86,36.85 22.83,36.88 21.49,36.88
$2N100308: length 1.3
  Top Layer w0.254: 19.81,51.46 21.04,51.46 21.09,51.51
$2N102721: length 2.9
  Top Layer w0.254: 7.82,46.33 7.8,46.31 6.42,46.31 ; 8.1,46.5 8.86,47.25 9.3,47.25
$3N29688: length 2.6
  Top Layer w0.254: 27.1,59.88 27.15,59.93 27.15,61.11 ; 27.19,61.31 28.38,61.31 28.47,61.22
$3N29714: length 2.7
  Top Layer w0.254: 28.41,54.35 28.38,54.33 27.08,54.33 27.09,54.34 27.09,55.71
$3N29818: length 2.5
  Top Layer w0.254: 31.26,61.32 31.17,61.23 30.06,61.23 30.06,60.02 30.02,59.98
$3N29868: length 2.6
  Top Layer w0.254: 31.17,54.25 31.12,54.3 29.94,54.3 ; 29.97,54.36 29.99,54.39 29.99,55.71
$3N30588: length 2.6
  Top Layer w0.254: 28.21,39.79 28.19,39.76 27.06,39.76 ; 27.06,39.76 27,39.7 ; 27.06,39.76 27.06,41.12
$3N30590: length 2.6
  Top Layer w0.254: 27.01,45.55 27.07,45.61 27.07,46.66 28.4,46.66 28.48,46.74
$3N30592: length 2.8
  Top Layer w0.254: 31.13,39.81 31.1,39.78 29.82,39.78 29.82,41.06 29.94,41.19
$3N30594: length 2.5
  Top Layer w0.254: 29.95,45.54 29.95,46.64 29.88,46.71 31.13,46.71 31.14,46.7
$3N31157: length 4.2
  Top Layer w0.254: 20.3,29.46 20.3,28.14 20.33,28.11 17.57,28.11 17.5,28.04
$3N31183: length 4
  Top Layer w0.254: 7.23,28.12 4.48,28.12 ; 4.49,29.44 4.49,28.19
$3N31377: length 2.7
  Top Layer w0.254: 19,28.81 19,29.32 ; 19,29.32 19,30.14 ; 19,29.32 18.98,29.3 17.64,29.3
$3N31382: length 2.7
  Top Layer w0.254: 5.83,28.86 5.85,28.88 5.85,29.37 ; 5.85,30.13 5.85,29.37 ; 5.85,29.37 7.19,29.37 7.23,29.32
$3N31753: length 4.5
  Top Layer w0.254: 42.57,27.94 42.59,27.96 42.59,29.33 ; 42.46,28.02 42.43,28.05 39.34,28.05
$3N31755: length 4
  Top Layer w0.254: 26.7,28.06 29.47,28.06 29.51,28.09 ; 26.7,29.35 26.7,28.12
$3N31761: length 2.7
  Top Layer w0.254: 41.28,29.26 41.28,29.26 39.91,29.26 ; 41.31,30.12 41.3,30.11 41.3,28.81
$3N31765: length 2.4
  Top Layer w0.254: 27.99,30.02 27.99,29.18 ; 27.99,29.18 27.99,28.9 27.99,28.89 ; 27.99,29.18 29.19,29.18 29.22,29.21
$3N32150: length 29
  Top Layer w0.508: 23.21,5.51 23.51,5.51 23.51,5.51 24.26,5.51 26.32,7.57 26.32,25.54 ; 23.21,5.51 16.3,5.51 16.23,5.59 ; 23.21,5.51 23.19,5.5
$3N32238: length 30.5
  Top Layer w0.508: 23.16,10.82 23.09,10.88 15.93,10.88 ; 4.36,25.53 4.36,21.39 6.73,19.02 10.35,19.02 12.5,16.88 12.5,12.03 13.54,10.98 16.12,10.98 16.24,11.1
$4N1442: length 16.8
  Top Layer w0.254: 16.07,63.78 16.1,63.82 ; 16.07,63.78 16.07,65.32 ; 16.07,63.78 14.68,63.78 ; 16.01,63.65 16.04,63.62 16.04,63.29 16.3,63.04 17.63,63.04 17.92,62.75 17.92,59.58 16.05,57.71 13.87,57.71 13.33,57.17 13.33,56.61 ; 14.53,61.69 14.55,61.71 14.55,63.76

## Copper pours and planes (outline as drawn; the poured copper is in the pictures)
5V on Top Layer: 23.82,77.74 25.45,77.74 25.45,75.34 23.82,75.34
5V on Bottom Layer: 23.83,77.74 25.47,77.74 25.47,76.49 23.83,76.49
AGND on Top Layer: 10.41,32.79 14.47,32.79 14.47,27.36 10.41,27.36
AGND on Top Layer: -7.86,89.26 53.55,89.26 53.55,-3.41 -7.86,-3.41
AGND on Top Layer: 32.7,32.63 36.69,32.63 36.69,27.3 32.7,27.3
AGND on Top Layer: 19.86,77.52 21.43,77.52 21.43,74.3 19.86,74.3
AGND on Bottom Layer: -9.2,90.62 52.32,90.62 52.32,-2.64 -9.2,-2.64

Small or netless copper shapes (teardrops, artwork), in the pictures only: 380 on Top Layer, 120 on Bottom Layer

## Text on the board
Bottom Silkscreen Layer: DESIGNED BY FANGXX3863 | HIFI-USB-DAC
Top Silkscreen Layer: JLCJLCJLCJLC
